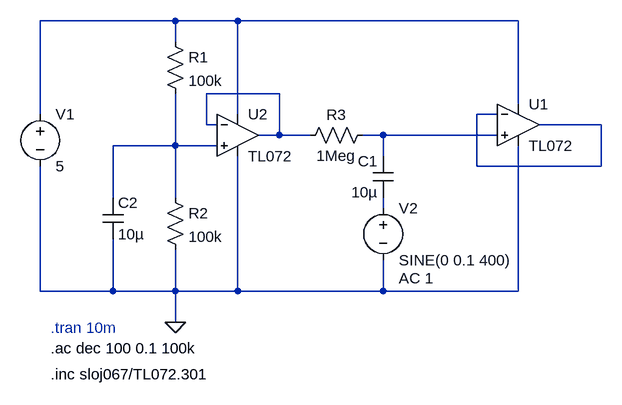
[diagram p0: schematic input_buffer.asc]
input_buffer.asc, the LTspice schematic file:
Version 4.1
SHEET 1 1288 680
WIRE 160 -128 -48 -128
WIRE 256 -128 160 -128
WIRE 688 -128 256 -128
WIRE 160 -96 160 -128
WIRE 320 -16 208 -16
WIRE 688 0 688 -128
WIRE -48 16 -48 -128
WIRE 256 16 256 -128
WIRE 656 16 624 16
WIRE 208 32 208 -16
WIRE 224 32 208 32
WIRE 816 32 720 32
WIRE 320 48 320 -16
WIRE 320 48 288 48
WIRE 368 48 320 48
WIRE 480 48 448 48
WIRE 656 48 480 48
WIRE 160 64 160 -16
WIRE 160 64 64 64
WIRE 224 64 160 64
WIRE 480 80 480 48
WIRE 624 96 624 16
WIRE 816 96 816 32
WIRE 816 96 624 96
WIRE 64 144 64 64
WIRE 160 144 160 64
WIRE 480 160 480 144
WIRE -48 288 -48 96
WIRE 64 288 64 208
WIRE 64 288 -48 288
WIRE 160 288 160 224
WIRE 160 288 64 288
WIRE 256 288 256 80
WIRE 256 288 160 288
WIRE 480 288 480 240
WIRE 480 288 256 288
WIRE 688 288 688 64
WIRE 688 288 480 288
WIRE 160 336 160 288
FLAG 160 336 0
SYMBOL voltage -48 0 R0
WINDOW 123 0 0 Left 0
WINDOW 39 0 0 Left 0
SYMATTR InstName V1
SYMATTR Value 5
SYMBOL voltage 480 144 R0
WINDOW 123 24 124 Left 2
WINDOW 39 0 0 Left 0
SYMATTR Value2 AC 1
SYMATTR InstName V2
SYMATTR Value SINE(0 0.1 400)
SYMBOL res 144 -112 R0
SYMATTR InstName R1
SYMATTR Value 100k
SYMBOL res 144 128 R0
SYMATTR InstName R2
SYMATTR Value 100k
SYMBOL res 352 64 R270
WINDOW 0 32 56 VTop 2
WINDOW 3 0 56 VBottom 2
SYMATTR InstName R3
SYMATTR Value 1Meg
SYMBOL cap 496 144 R180
WINDOW 0 24 56 Left 2
WINDOW 3 24 8 Left 2
SYMATTR InstName C1
SYMATTR Value 10µ
SYMBOL cap 48 144 R0
SYMATTR InstName C2
SYMATTR Value 10µ
SYMBOL OpAmps\\opamp2 688 -32 R0
SYMATTR InstName U1
SYMATTR Value TL072
SYMBOL OpAmps\\opamp2 256 -16 R0
SYMATTR InstName U2
SYMATTR Value TL072
TEXT -32 344 Left 2 ;.tran 10m
TEXT -32 376 Left 2 !.ac dec 100 0.1 100k
TEXT -32 416 Left 2 !.inc sloj067/TL072.301

The netlist it stands for:
* input_buffer.asc
V1 N001 0 5
V2 N006 0 SINE(0 0.1 400) AC 1
R1 N001 N005 100k
R2 N005 0 100k
R3 N002 N004 1Meg
C1 N006 N004 10µ
C2 N005 0 10µ
X§U1 N004 N003 N001 0 N003 TL072  ; pins In+ In- V+ V- OUT
X§U2 N005 N002 N001 0 N002 TL072  ; pins In+ In- V+ V- OUT
* .tran 10m
.ac dec 100 0.1 100k
.inc sloj067/TL072.301
.backanno
.end